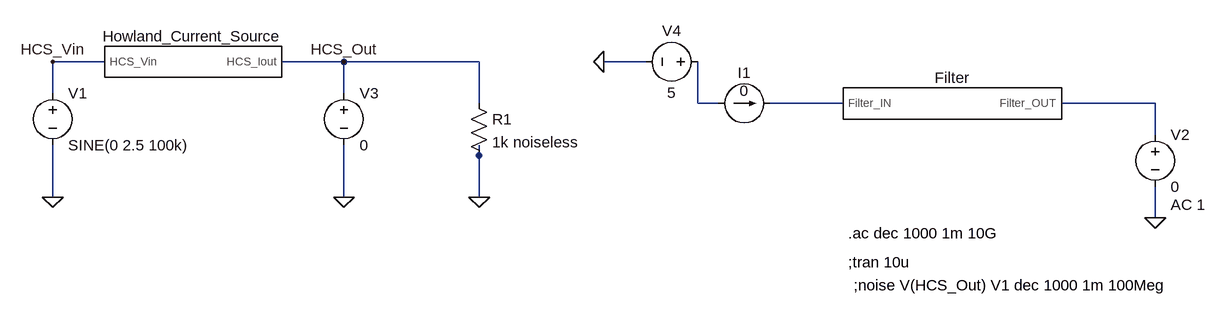
[diagram p0: schematic ToneGen_TopLevel.asc]
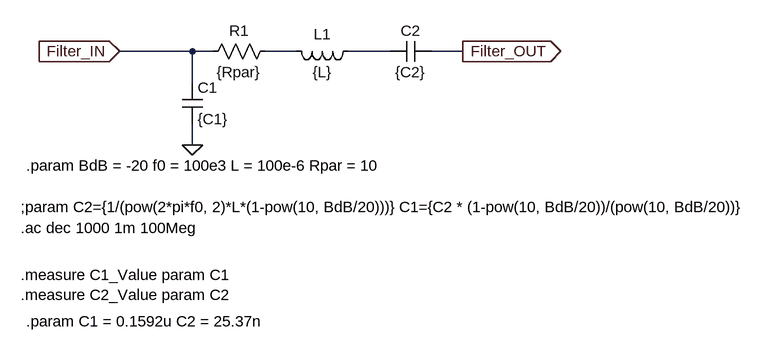
[diagram p1: sub-circuit filter_model.asc]
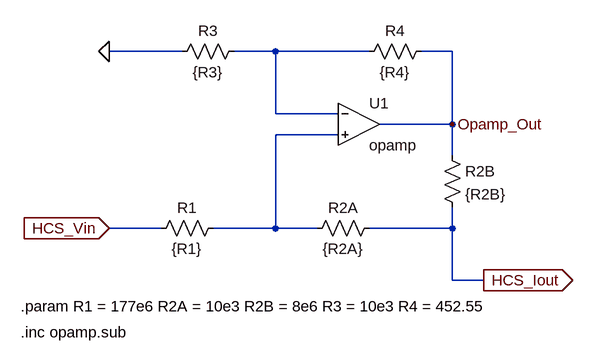
[diagram p2: sub-circuit hcs_model.asc]
ToneGen_TopLevel.asc, the LTspice schematic file:
Version 4
SHEET 1 880 964
WIRE -1296 -144 -1376 -144
WIRE -928 -144 -1024 -144
WIRE -720 -144 -928 -144
WIRE -464 -144 -528 -144
WIRE -1376 -96 -1376 -144
WIRE -928 -96 -928 -144
WIRE -720 -80 -720 -144
WIRE -384 -80 -384 -144
WIRE -352 -80 -384 -80
WIRE -160 -80 -272 -80
WIRE 320 -80 176 -80
WIRE 320 -32 320 -80
WIRE -720 0 -720 -16
WIRE -1376 64 -1376 -16
WIRE -928 64 -928 -16
WIRE -720 64 -720 0
WIRE 320 96 320 48
FLAG 320 96 0
FLAG -1376 64 0
FLAG -928 64 0
FLAG -1376 -144 HCS_Vin
FLAG -528 -144 0
FLAG -928 -144 HCS_Out
FLAG -720 64 0
SYMBOL voltage 320 -48 R0
WINDOW 123 24 124 Left 2
WINDOW 39 0 0 Left 0
SYMATTR Value2 AC 1
SYMATTR InstName V2
SYMATTR Value 0
SYMBOL Filter_Model 0 -80 R0
SYMATTR InstName Filter
SYMBOL HCS_model -1168 -144 R0
SYMATTR InstName Howland_Current_Source
SYMBOL voltage -1376 -112 R0
WINDOW 123 24 44 Left 2
WINDOW 39 0 0 Left 0
SYMATTR InstName V1
SYMATTR Value SINE(0 2.5 100k)
SYMBOL voltage -928 -112 R0
WINDOW 123 0 0 Left 0
WINDOW 39 0 0 Left 0
SYMATTR InstName V3
SYMATTR Value 0
SYMBOL current -352 -80 R270
WINDOW 0 32 40 VTop 2
WINDOW 3 4 40 VTop 2
WINDOW 123 -60 40 VBottom 2
WINDOW 39 0 0 Left 0
SYMATTR InstName I1
SYMATTR Value 0
SYMBOL voltage -368 -144 R90
WINDOW 0 -32 56 VBottom 2
WINDOW 3 32 56 VTop 2
WINDOW 123 0 0 Left 0
WINDOW 39 0 0 Left 0
SYMATTR InstName V4
SYMATTR Value 5
SYMBOL res -736 -96 R0
SYMATTR InstName R1
SYMATTR Value 1k noiseless
TEXT -152 120 Left 2 !.ac dec 1000 1m 10G
TEXT -152 164 Left 2 !;tran 10u
TEXT -144 200 Left 2 !;noise V(HCS_Out) V1 dec 1000 1m 100Meg

filter_model.asc, the sub-circuit schematic file:
Version 4
SHEET 1 1212 680
WIRE 160 112 48 112
WIRE 192 112 160 112
WIRE 320 112 272 112
WIRE 464 112 400 112
WIRE 576 112 528 112
WIRE 160 160 160 112
WIRE 160 256 160 224
FLAG 160 256 0
FLAG 48 112 Filter_IN
IOPIN 48 112 In
FLAG 576 112 Filter_OUT
IOPIN 576 112 Out
SYMBOL cap 144 160 R0
SYMATTR InstName C1
SYMATTR Value {C1}
SYMBOL ind 416 96 R90
WINDOW 0 5 56 VBottom 2
WINDOW 3 32 56 VTop 2
SYMATTR InstName L1
SYMATTR Value {L}
SYMBOL cap 528 96 R90
WINDOW 0 0 32 VBottom 2
WINDOW 3 32 32 VTop 2
SYMATTR InstName C2
SYMATTR Value {C2}
SYMBOL res 288 96 R90
WINDOW 0 0 56 VBottom 2
WINDOW 3 32 56 VTop 2
SYMATTR InstName R1
SYMATTR Value {Rpar}
TEXT -104 352 Left 2 !;param C2={1/(pow(2*pi*f0, 2)*L*(1-pow(10, BdB/20)))} C1={C2 * (1-pow(10, BdB/20))/(pow(10, BdB/20))}
TEXT -104 384 Left 2 !.ac dec 1000 1m 100Meg
TEXT -96 288 Left 2 !.param BdB = -20 f0 = 100e3 L = 100e-6 Rpar = 10
TEXT -104 456 Left 2 !.measure C1_Value param C1\n.measure C2_Value param C2
TEXT -96 528 Left 2 !.param C1 = 0.1592u C2 = 25.37n

hcs_model.asc, the sub-circuit schematic file:
Version 4
SHEET 1 880 680
WIRE -96 80 -208 80
WIRE 48 80 -16 80
WIRE 192 80 48 80
WIRE 320 80 272 80
WIRE 48 176 48 80
WIRE 144 176 48 176
WIRE 320 192 320 80
WIRE 320 192 208 192
WIRE 144 208 48 208
WIRE 320 240 320 192
WIRE -128 352 -208 352
WIRE 48 352 48 208
WIRE 48 352 -48 352
WIRE 112 352 48 352
WIRE 320 352 320 320
WIRE 320 352 192 352
WIRE 320 432 320 352
WIRE 368 432 320 432
FLAG -208 80 0
FLAG -208 352 HCS_Vin
IOPIN -208 352 In
FLAG 368 432 HCS_Iout
IOPIN 368 432 Out
FLAG 320 192 Opamp_Out
SYMBOL OpAmps\\opamp 176 128 R0
SYMATTR InstName U1
SYMATTR SpiceLine2 GBW=110Meg
SYMBOL res 304 224 R0
SYMATTR InstName R2B
SYMATTR Value {R2B}
SYMBOL res 208 336 R90
WINDOW 0 0 56 VBottom 2
WINDOW 3 32 56 VTop 2
SYMATTR InstName R2A
SYMATTR Value {R2A}
SYMBOL res 288 64 R90
WINDOW 0 0 56 VBottom 2
WINDOW 3 32 56 VTop 2
SYMATTR InstName R4
SYMATTR Value {R4}
SYMBOL res 0 64 R90
WINDOW 0 0 56 VBottom 2
WINDOW 3 32 56 VTop 2
SYMATTR InstName R3
SYMATTR Value {R3}
SYMBOL res -32 336 R90
WINDOW 0 0 56 VBottom 2
WINDOW 3 32 56 VTop 2
SYMATTR InstName R1
SYMATTR Value {R1}
TEXT -344 472 Left 2 !.param R1 = 177e6 R2A = 10e3 R2B = 8e6 R3 = 10e3 R4 = 452.55
TEXT -344 512 Left 2 !.inc opamp.sub

The netlist it stands for:
* ToneGen_TopLevel.asc
V2 N003 0 0 AC 1
XFilter N002 N003 filter_model
XHowland_Current_Source HCS_Vin HCS_Out hcs_model
V1 HCS_Vin 0 SINE(0 2.5 100k)
V3 HCS_Out 0 0
I1 N001 N002 0
V4 N001 0 5
R1 HCS_Out 0 1k noiseless

* block symbol definitions
.subckt filter_model Filter_IN Filter_OUT
C1 Filter_IN 0 {C1}
L1 N002 N001 {L}
C2 Filter_OUT N002 {C2}
R1 N001 Filter_IN {Rpar}
;param C2={1/(pow(2*pi*f0, 2)*L*(1-pow(10, BdB/20)))} C1={C2 * (1-pow(10, BdB/20))/(pow(10, BdB/20))}
.ac dec 1000 1m 100Meg
.param BdB = -20 f0 = 100e3 L = 100e-6 Rpar = 10
.measure C1_Value param C1
.measure C2_Value param C2
.param C1 = 0.1592u C2 = 25.37n
.ends filter_model

.subckt hcs_model HCS_Vin HCS_Iout
XU1 N001 N002 Opamp_Out opamp Aol=100K GBW=110Meg  ; pins invin noninvin out
R2B Opamp_Out HCS_Iout {R2B}
R2A HCS_Iout N002 {R2A}
R4 Opamp_Out N001 {R4}
R3 N001 0 {R3}
R1 N002 HCS_Vin {R1}
.param R1 = 177e6 R2A = 10e3 R2B = 8e6 R3 = 10e3 R4 = 452.55
.inc opamp.sub
.ends hcs_model

.ac dec 1000 1m 10G
;tran 10u
;noise V(HCS_Out) V1 dec 1000 1m 100Meg
.backanno
.end